# Altium schematic sheet Serial_Bluetooth.SchDoc
size A
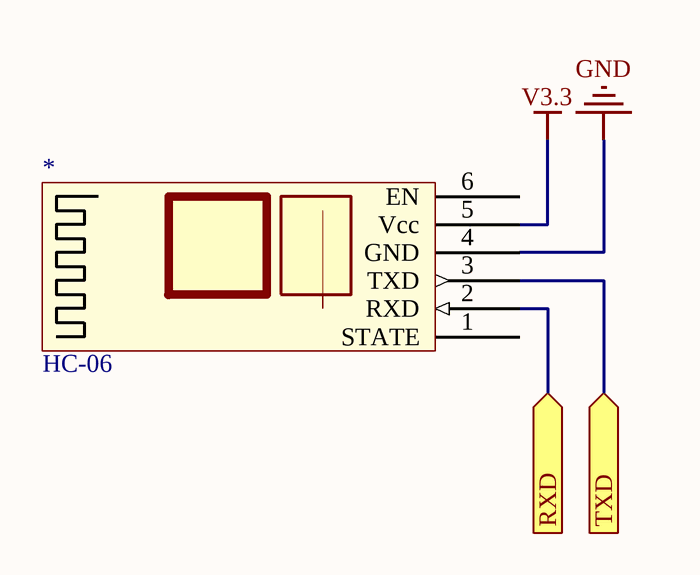
[diagram p0: Serial_Bluetooth.SchDoc]

## Parts
*  HC-06

## Ports
RXD (in), TXD (in)

## Nets
GND: *.4(GND)
V3.3: *.5(Vcc)
RXD: *.2(RXD) ; port RXD
TXD: *.3(TXD) ; port TXD

Not connected (* = marked no-connect by the designer): * 1(STATE) 6(EN)